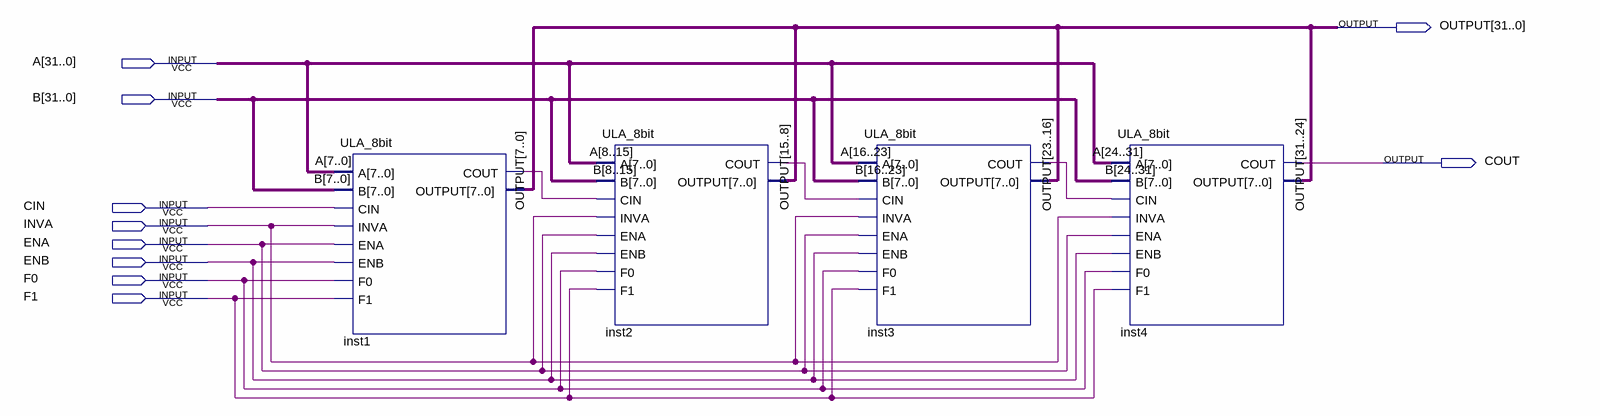
[diagram p0: schematic sheet]
// Quartus schematic ULA_32bit.bdf as structural Verilog: 4 symbols, 10 pins
module ULA_32bit (
  input  [31:0] A,
  input  [31:0] B,
  input  CIN,
  input  INVA,
  input  ENA,
  input  ENB,
  input  F0,
  input  F1,
  output [31:0] OUTPUT,
  output COUT
);

  wire inst1_cout, inst2_cout, inst3_cout;

  ULA_8bit inst1 (
    .A(A[7:0]), .B(B[7:0]), .CIN(CIN), .INVA(INVA), .ENA(ENA), .ENB(ENB), .F0(F0), .F1(F1),
    .COUT(inst1_cout), .OUTPUT(OUTPUT[7:0]));
  ULA_8bit inst2 (
    .A({A[8], A[9], A[10], A[11], A[12], A[13], A[14], A[15]}),
    .B({B[8], B[9], B[10], B[11], B[12], B[13], B[14], B[15]}), .CIN(inst1_cout), .INVA(INVA), .ENA(ENA),
    .ENB(ENB), .F0(F0), .F1(F1), .COUT(inst2_cout), .OUTPUT(OUTPUT[15:8]));
  ULA_8bit inst3 (
    .A({A[16], A[17], A[18], A[19], A[20], A[21], A[22], A[23]}),
    .B({B[16], B[17], B[18], B[19], B[20], B[21], B[22], B[23]}), .CIN(inst2_cout), .INVA(INVA), .ENA(ENA),
    .ENB(ENB), .F0(F0), .F1(F1), .COUT(inst3_cout), .OUTPUT(OUTPUT[23:16]));
  ULA_8bit inst4 (
    .A({A[24], A[25], A[26], A[27], A[28], A[29], A[30], A[31]}),
    .B({B[24], B[25], B[26], B[27], B[28], B[29], B[30], B[31]}), .CIN(inst3_cout), .INVA(INVA), .ENA(ENA),
    .ENB(ENB), .F0(F0), .F1(F1), .COUT(COUT), .OUTPUT(OUTPUT[31:24]));
endmodule
